# Altium schematic sheet LCD.SchDoc
size A
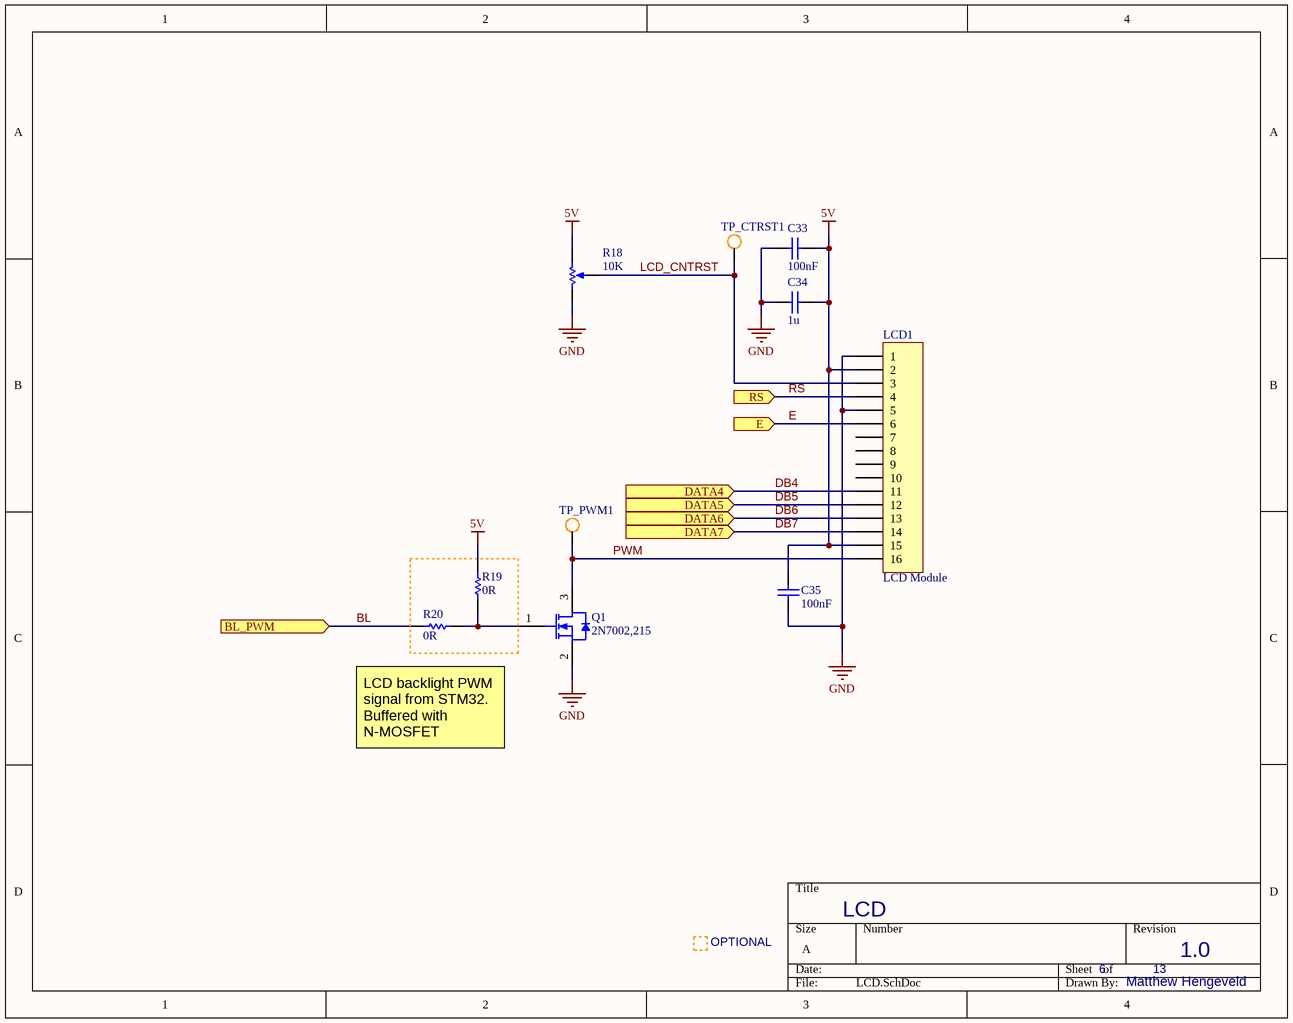
[diagram p0: LCD.SchDoc]

## Parts
C33  100nF  [CAPC1608X92X38LL15T08]
C34  1u  [CAPC2013X94X50LL20T25]
C35  100nF  [CAPC1608X92X38LL15T08]
LCD1  LCD Module  [LCD Module]
Q1  2N7002,215  [NXP-SOT23_L]
R18  10K  [BOUR-3266W-3_V]
R19  0R  [RESC1609X55X30LL10T20]
R20  0R  [RESC1609X55X30LL10T20]
TP_CTRST1  Test point  [SMD Test Hook]  (value not drawn)
TP_PWM1  Test point  [SMD Test Hook]  (value not drawn)

## Ports
BL_PWM (in), DATA4 (in), DATA5 (in), DATA6 (in), DATA7 (in), E (in), RS (in)

## Nets
5V: C33.1 C34.1 C35.2 LCD1.2 LCD1.15 R18.1(CCW) R19.2
GND: C33.2 C34.2 C35.1 LCD1.1 LCD1.5 Q1.2(S) R18.3(CW)
BL: R20.2 ; port BL_PWM
DB4: LCD1.11 ; port DATA4
DB5: LCD1.12 ; port DATA5
DB6: LCD1.13 ; port DATA6
DB7: LCD1.14 ; port DATA7
E: LCD1.6 ; port E
LCD_CNTRST: LCD1.3 R18.2(WIPER) TP_CTRST1.1(point)
PWM: LCD1.16 Q1.3(D) TP_PWM1.1(point)
RS: LCD1.4 ; port RS
NetQ1_1: Q1.1(G) R19.1 R20.1

Not connected (* = marked no-connect by the designer): LCD1 7 8 9 10

## Notes on the sheet
- LCD backlight PWM signal from STM32. Buffered with N-MOSFET
- OPTIONAL
- LCD
- 6
- 13
- 1.0
- Matthew Hengeveld

## Library data of the parts
C33 C35 = CMP-2006-01974-1: Part Number: VJ0603Y104KNXAO; Manufacturer: Vitramon
C34 = CMP-2007-04370-1: Part Number: 08055C104K4T2A; Manufacturer: AVX Interconnect / Elco
LCD1 = LCD Module: Header, 16-Pin; LatestRevisionDate: 17-Jul-2002; LatestRevisionNote: Re-released for DXP Platform.; Publisher: Altium Limited
Q1 = CMP-1258-00136-1: N-Channel Trench MOSFET, 60 V, 0.3 A, 3-Pin SOT23, Tape and Reel; Manufacturer: NXP Semiconductors; ID [max] (A): 0.3; Channel Type: N; VDS [max] (V): 60; Packing: Tape & Reel; VGSth [typ] (V): 2; Qr [typ] (nC): 30; Coss [typ] (pF): 6.8; Ciss [typ] (pF): 31; Mounting Technology: Surface Mount; PackageReference: SOT23; ComponentLink3Description: Package Specification; ComponentLink2Description: Datasheet; DatasheetVersion: Rev. 7; PackageVersion: 06-03-16, 03/2006; ComponentLink2URL: http://www.nxp.com/documents/data_sheet/2N7002.pdf; PackageDescription: 3-Pin Small Outline Transistor Package, Body 2.9 x 1.3 mm, Pitch 0.95 mm; PartNumber: 2N7002,215; ComponentLink1URL: http://www.nxp.com/; ComponentLink1Description: Manufacturer URL; Code_JEDEC: TO-236AB; ComponentLink3URL: http://www.nxp.com/documents/outline_drawing/sot023_po.pdf
R18 = CMP-0975-00021-1: Square Trimpot Trimming Potentiometer, 100 KOhm, 0.25 W, -55 to 125 degC, 3-Pin THD, RoHS, Tube; Manufacturer: Bourns; PartNumber: 3266W-1-104LF; Power Rating@70 degC: 0.25 W; Tolerance: +/-10%; ComponentLink2URL: https://www.bourns.com/data/global/pdfs/3266.pdf; ComponentLink3Description: Package Specification; ComponentLink1URL: https://www.bourns.com/; ComponentLink2Description: Datasheet; DatasheetVersion: Apr-14; ComponentLink3URL: https://www.bourns.com/data/global/pdfs/3266.pdf; Mounting Technology: Through Hole; Packing: Tube; PackageDescription: 3-Pin THD, Body 6.35 x 4.31 mm, Pitch 2.54 mm; ComponentLink1Description: Manufacturer URL; Operating Temperature: -55 to 125 degC; Resistance: 100 kOhm; RoHS: TRUE
R19 R20 = CMP-2000-03816-1: Part Number: CRCW06030000Z0EA; Manufacturer: Vishay Dale